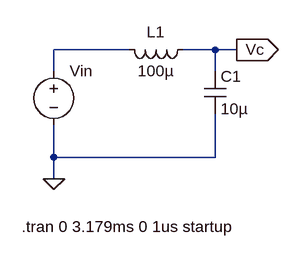
[diagram p0: schematic LC.asc]
LC.asc, the LTspice schematic file:
Version 4
SHEET 1 880 680
WIRE 400 240 288 240
WIRE 528 240 480 240
WIRE 560 240 528 240
WIRE 288 272 288 240
WIRE 528 272 528 240
WIRE 288 400 288 352
WIRE 528 400 528 336
WIRE 528 400 288 400
WIRE 288 432 288 400
FLAG 560 240 Vc
IOPIN 560 240 Out
FLAG 288 432 0
SYMBOL voltage 288 256 R0
WINDOW 3 24 96 Invisible 2
SYMATTR InstName Vin
SYMATTR Value PULSE(0 1 0 1us 1us 3.179ms 6.358ms)
SYMBOL ind 496 224 R90
WINDOW 0 5 56 VBottom 2
WINDOW 3 32 56 VTop 2
SYMATTR InstName L1
SYMATTR Value 100µ
SYMATTR SpiceLine Ipk=1 Rser=85m Rpar=infin. Cpar=0 mfg="Coiltronics" pn="CTX100-1-52"
SYMBOL cap 512 272 R0
SYMATTR InstName C1
SYMATTR Value 10µ
TEXT 240 504 Left 2 !.tran 0 3.179ms 0 1us startup

The netlist it stands for:
* LC.asc
Vin N001 0 PULSE(0 1 0 1us 1us 3.179ms 6.358ms)
L1 Vc N001 100µ Ipk=1 Rser=85m Rpar=infin. Cpar=0 mfg="Coiltronics" pn="CTX100-1-52"
C1 Vc 0 10µ
.tran 0 3.179ms 0 1us startup
.backanno
.end